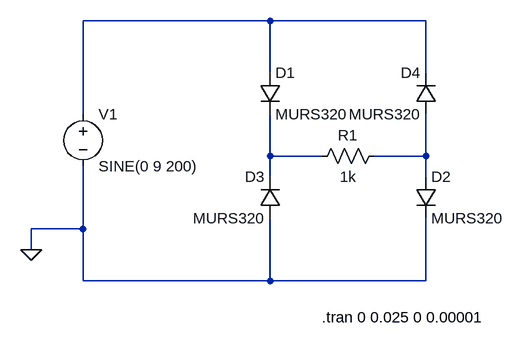
[diagram p0: schematic 19201063_Lab2_Full_Wave.asc]
19201063_Lab2_Full_Wave.asc, the LTspice schematic file:
Version 4
SHEET 1 880 680
WIRE 256 -96 -32 -96
WIRE 496 -96 256 -96
WIRE 256 -16 256 -96
WIRE 496 -16 496 -96
WIRE -32 48 -32 -96
WIRE 256 112 256 48
WIRE 336 112 256 112
WIRE 496 112 496 48
WIRE 496 112 416 112
WIRE 256 144 256 112
WIRE 496 144 496 112
WIRE -32 224 -32 128
WIRE -32 224 -112 224
WIRE -112 256 -112 224
WIRE -32 304 -32 224
WIRE 256 304 256 208
WIRE 256 304 -32 304
WIRE 496 304 496 208
WIRE 496 304 256 304
FLAG -112 256 0
SYMBOL voltage -32 32 R0
WINDOW 123 0 0 Left 0
WINDOW 39 0 0 Left 0
SYMATTR InstName V1
SYMATTR Value SINE(0 9 200)
SYMBOL diode 240 -16 R0
SYMATTR InstName D1
SYMATTR Value MURS320
SYMBOL diode 480 144 R0
SYMATTR InstName D2
SYMATTR Value MURS320
SYMBOL diode 272 208 R180
WINDOW 0 24 64 Left 2
WINDOW 3 24 0 Left 2
SYMATTR InstName D3
SYMATTR Value MURS320
SYMBOL diode 512 48 R180
WINDOW 0 24 64 Left 2
WINDOW 3 24 0 Left 2
SYMATTR InstName D4
SYMATTR Value MURS320
SYMBOL res 432 96 R90
WINDOW 0 0 56 VBottom 2
WINDOW 3 32 56 VTop 2
SYMATTR InstName R1
SYMATTR Value 1k
TEXT 336 360 Left 2 !.tran 0 0.025 0 0.00001

The netlist it stands for:
* 19201063_Lab2_Full_Wave.asc
V1 N001 0 SINE(0 9 200)
D1 N001 N002 MURS320
D2 N003 0 MURS320
D3 0 N002 MURS320
D4 N003 N001 MURS320
R1 N003 N002 1k
.model D D
.lib standard.dio
.tran 0 0.025 0 0.00001
.backanno
.end